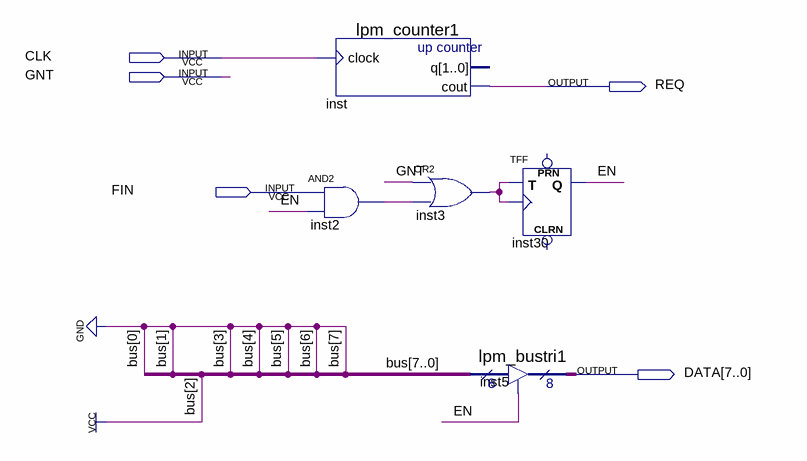
[diagram p0: schematic sheet]
// Quartus schematic master4.bdf as structural Verilog: 5 symbols, 5 pins
module master4 (
  input  CLK,
  input  GNT,
  input  FIN,
  output REQ,
  output [7:0] DATA
);

  wire EN, inst2_out, inst3_out;

  lpm_counter1 inst (.clock(CLK), .cout(REQ));  // open: q
  and inst2 (inst2_out, FIN, EN);
  or inst3 (inst3_out, GNT, inst2_out);
  lpm_bustri1 inst5 (.enabledt(EN), .data(8'b00000100), .tridata(DATA));
  TFF inst30 (.T(inst3_out), .CLK(inst3_out), .Q(EN));  // open: PRN, CLRN
endmodule
